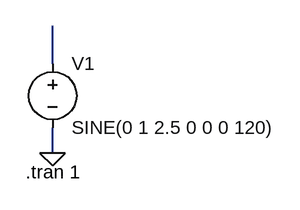
[diagram p0: schematic Draft1.asc]
Draft1.asc, the LTspice schematic file:
Version 4
SHEET 1 880 680
WIRE -64 96 -64 48
WIRE -64 208 -64 176
FLAG -64 208 0
SYMBOL voltage -64 80 R0
WINDOW 123 0 0 Left 0
WINDOW 39 0 0 Left 0
SYMATTR InstName V1
SYMATTR Value SINE(0 1 2.5 0 0 0 120)
TEXT -98 232 Left 2 !.tran 1

The netlist it stands for:
* Draft1.asc
V1 N001 0 SINE(0 1 2.5 0 0 0 120)
.tran 1
.backanno
.end